# EAGLE schematic APPS_8df (EAGLE 9.6.2)
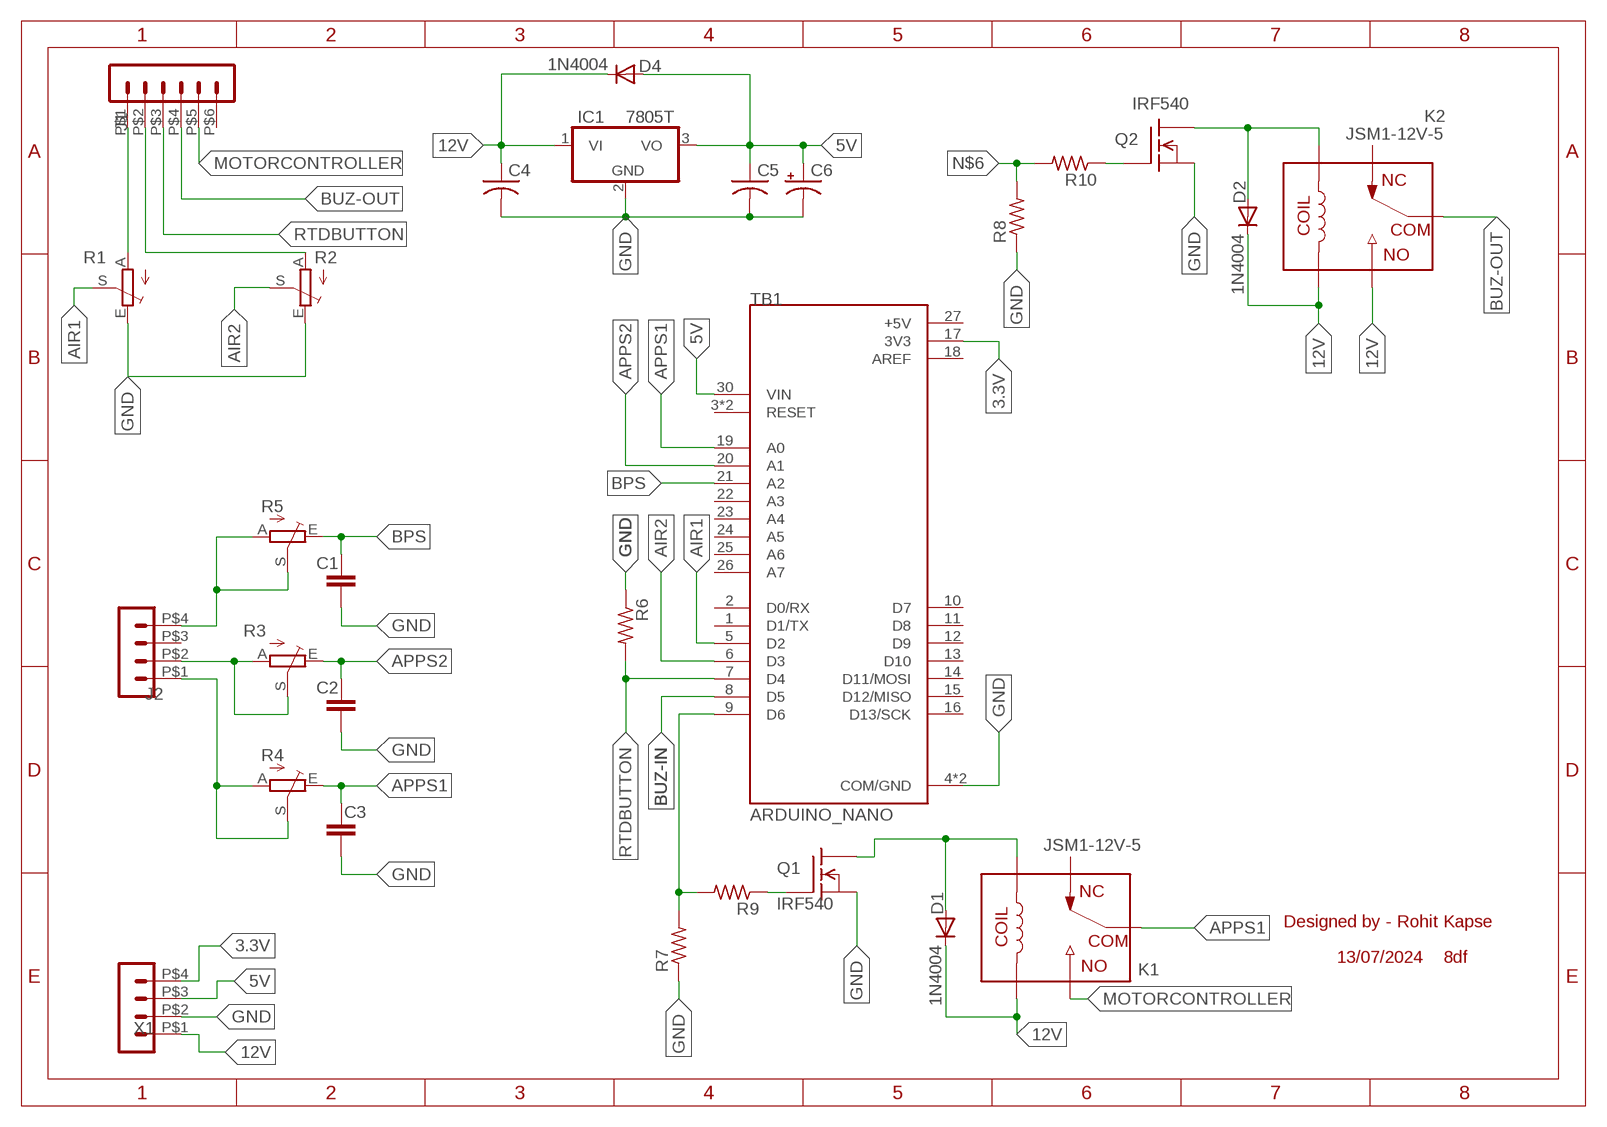
[diagram p0: schematic, sheet 1]

## Parts
C1  C-EU025-025X050  [C025-025X050]
C2  C-EU025-025X050  [C025-025X050]
C3  C-EU025-025X050  [C025-025X050]
C4  C-US025-025X050  [C025-025X050]
C5  C-US025-025X050  [C025-025X050]
C6  CPOL-USE2.5-7  [E2,5-7]
D1  1N4004  [DO41-10]
D2  1N4004  [DO41-10]
D4  1N4004  [DO41-10]
IC1  7805T  [TO220H]
J1  HEADER_POS6_43045-0612  [43045-0612]
J2  HEADER_POS4_43045-0412  [43045-0412]
K1  JSM1-12V-5  [JSM1-12V-5]
K2  JSM1-12V-5  [JSM1-12V-5]
Q1  IRF540  [TO220]
Q2  IRF540  [TO220]
R1  TRIM_EU-S64W  [S64W]
R2  TRIM_EU-S64W  [S64W]
R3  TRIM_EU-S64W  [S64W]
R4  TRIM_EU-S64W  [S64W]
R5  TRIM_EU-S64W  [S64W]
R6  R-US_0207/10  [0207/10]
R7  R-US_0207/10  [0207/10]
R8  R-US_0207/10  [0207/10]
R9  R-US_0207/10  [0207/10]
R10  R-US_0207/10  [0207/10]
TB1  ARDUINO_NANO  [SHIELD_ARDUINO_NANO]
X1  HEADER_POS4_43045-0412  [43045-0412]

## Nets
3.3V: TB1.17(3V3) X1.P$4
5V: C5.1 C6.+ D4.A IC1.3(VO) TB1.30(VIN) X1.P$3
12V: C4.1 D1.C D2.C D4.C IC1.1(VI) K1.2 K2.2 K2.3 X1.P$1
AIR1: J1.P$1 R1.A R1.S TB1.5(D2)
AIR2: J1.P$2 R2.A R2.S TB1.6(D3)
APPS1: C3.1 K1.1 R4.E TB1.19(A0)
APPS2: C2.2 R3.E TB1.20(A1)
BPS: C1.2 R5.E TB1.21(A2)
BUZ-IN: Q2.1(G) R10.1 TB1.8(D5)
BUZ-OUT: J1.P$4 K2.1
GND: C1.1 C2.1 C3.2 C4.2 C5.2 C6.- IC1.2(GND) Q1.3(S) Q2.3(S) R1.E R2.E R6.1 R7.1 R8.1 TB1.4(COM/GND) TB1.29(COM/GND) X1.P$2
MOTORCONTROLLER: J1.P$5 K1.3
N$1: J2.P$2 R3.A R3.S
N$2: J2.P$1 R4.A R4.S
N$3: D1.A K1.5 Q1.2(D)
N$4: J2.P$4 R5.A R5.S
N$5: Q1.1(G) R9.1
N$6: R8.2 R10.2
N$7: R7.2 R9.2 TB1.9(D6)
N$9: D2.A K2.5 Q2.2(D)
RTDBUTTON: J1.P$3 R6.2 TB1.7(D4)
Unconnected: J1.P$6 J2.P$3 K1.4 K2.4 TB1.1(D1/TX) TB1.2(D0/RX) TB1.3(RESET) TB1.10(D7) TB1.11(D8) TB1.12(D9) TB1.13(D10) TB1.14(D11/MOSI) TB1.15(D12/MISO) TB1.16(D13/SCK) TB1.22(A3) TB1.23(A4) TB1.24(A5) TB1.25(A6) TB1.26(A7) TB1.28(RESET)

## Notes on the sheet
- Designed by - Rohit Kapse
- 13/07/2024 | 8df

## Power pins joined to a net without a drawn wire
+5V: TB1.27(+5V)
AREF: TB1.18(AREF)

## Library data of the parts
C1-C3 = ALL IMP LIB:C-EU: CAPACITOR, European symbol
C4 C5 = adafruit:C-US: CAPACITOR, American symbol
C6 = adafruit:CPOL-US: POLARIZED CAPACITOR, American symbol
D1 D2 D4 = ALL IMP LIB:1N4004: DIODE General purpose 1N400x type rectifier (With bigger pads) http://www.ladyada.net/library/pcb/eaglelibrary.html
IC1 = adafruit:78*: Positive VOLTAGE REGULATOR Added bigger pads to the TO-92 package
J1 = ALL IMP LIB:HEADER_POS6_?: Molex - Micro-Fit 3.0 Series connector, 3.00mm (0.118") pitch header, 6 positions.
J2 X1 = ALL IMP LIB:HEADER_POS4_?: Molex - Micro-Fit 3.0 Series connector, 3.00mm (0.118") pitch header, 4 positions.
K1 K2 = Relay:JSM1-12V-5: RELAY AUTOMOTIVE SPDT 15A 12V Manufacturer's datasheet <https://media.digikey.com/pdf/Data%20Sheets/Panasonic%20Electric%20Works%20PDFs/JS-M_Series_Rev_Dec_2011.pdf>; CREATED_BY: PCBLayout.com; DIGIKEY_PARTNO: 255-1240-ND; MANUFACTURER: Panasonic Electric Works; MPN: JSM1-12V-5
Q1 Q2 = transistor-fet:IRF540: N-Channel Enhancement MOSFET (HEXFET); 100V; 28A; 0,077Ohm
R1-R5 = ALL IMP LIB:TRIM_EU-: POTENTIOMETER
R6 = adafruit:R-US_: RESISTOR, American symbol
R7-R10 = ALL IMP LIB:R-US_: RESISTOR, American symbol
TB1 = ARDUINO_NANO (1):ARDUINO_NANO: Arduino Nano, Through Hole Check availability <https://pricing.snapeda.com/parts/Arduino%20Nano/Arduino/view-part?ref=eda>; AVAILABILITY: Not in stock; CHECK_PRICES: https://www.snapeda.com/parts/Arduino%20Nano/Arduino/view-part/?ref=eda; DESCRIPTION: Small, complete, and breadboard-friendly board based on the ATmega328 (Arduino Nano 3.x); MF: Arduino; MP: Arduino Nano; PACKAGE: Non-Standard Arduino; PRICE: None; SNAPEDA_LINK: https://www.snapeda.com/parts/Arduino%20Nano/Arduino/view-part/?ref=snap